# EAGLE design untitled_full_Rs (EAGLE 5.07)
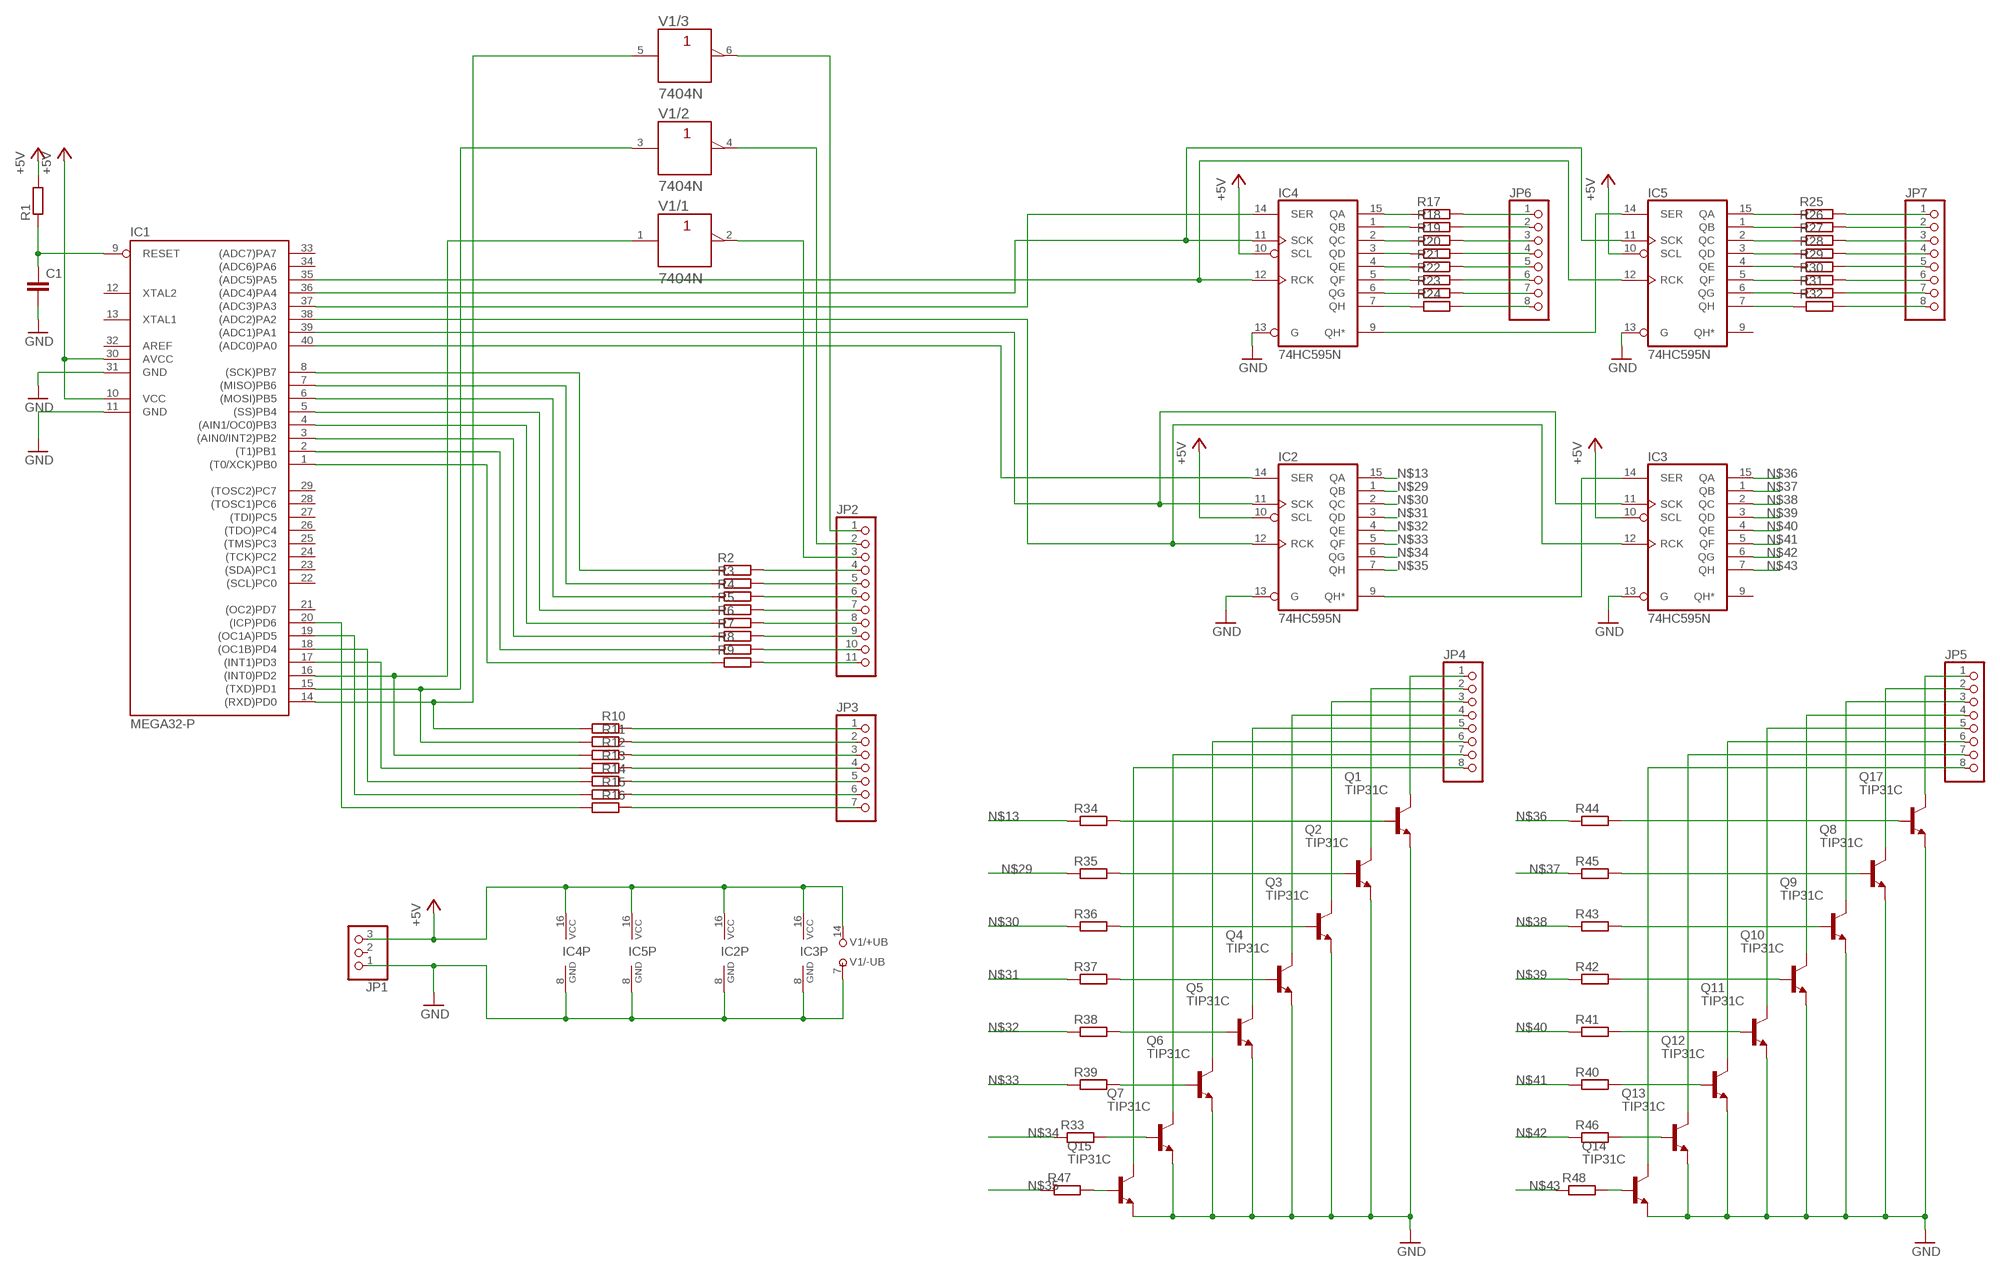
[diagram p0: schematic, sheet 1]

## Parts
C1  C-EU050-024X044  [C050-024X044]
IC1  MEGA32-P  [DIL40]
IC2  74HC595N  [DIL16]
IC3  74HC595N  [DIL16]
IC4  74HC595N  [DIL16]
IC5  74HC595N  [DIL16]
JP1  PINHD-1X3/90  [1X03/90]
JP2  PINHD-1X11/90  [1X11/90]
JP3  PINHD-1X7/90  [1X07/90]
JP4  PINHD-1X8/90  [1X08/90]
JP5  PINHD-1X8/90  [1X08/90]
JP6  PINHD-1X8/90  [1X08/90]
JP7  PINHD-1X8/90  [1X08/90]
Q1  TIP31C  [TO220]
Q2  TIP31C  [TO220]
Q3  TIP31C  [TO220]
Q4  TIP31C  [TO220]
Q5  TIP31C  [TO220]
Q6  TIP31C  [TO220]
Q7  TIP31C  [TO220]
Q8  TIP31C  [TO220]
Q9  TIP31C  [TO220]
Q10  TIP31C  [TO220]
Q11  TIP31C  [TO220]
Q12  TIP31C  [TO220]
Q13  TIP31C  [TO220]
Q14  TIP31C  [TO220]
Q15  TIP31C  [TO220]
Q17  TIP31C  [TO220]
R1  R-EU_0204/7  [0204/7]
R2  R-EU_0207/12  [0207/12]
R3  R-EU_0207/12  [0207/12]
R4  R-EU_0207/12  [0207/12]
R5  R-EU_0207/12  [0207/12]
R6  R-EU_0207/12  [0207/12]
R7  R-EU_0207/12  [0207/12]
R8  R-EU_0207/12  [0207/12]
R9  R-EU_0207/12  [0207/12]
R10  R-EU_0207/12  [0207/12]
R11  R-EU_0207/12  [0207/12]
R12  R-EU_0207/12  [0207/12]
R13  R-EU_0207/12  [0207/12]
R14  R-EU_0207/12  [0207/12]
R15  R-EU_0207/12  [0207/12]
R16  R-EU_0207/12  [0207/12]
R17  R-EU_0207/12  [0207/12]
R18  R-EU_0207/12  [0207/12]
R19  R-EU_0207/12  [0207/12]
R20  R-EU_0207/12  [0207/12]
R21  R-EU_0207/12  [0207/12]
R22  R-EU_0207/12  [0207/12]
R23  R-EU_0207/12  [0207/12]
R24  R-EU_0207/12  [0207/12]
R25  R-EU_0207/12  [0207/12]
R26  R-EU_0207/12  [0207/12]
R27  R-EU_0207/12  [0207/12]
R28  R-EU_0207/12  [0207/12]
R29  R-EU_0207/12  [0207/12]
R30  R-EU_0207/12  [0207/12]
R31  R-EU_0207/12  [0207/12]
R32  R-EU_0207/12  [0207/12]
R33  R-EU_0207/12  [0207/12]
R34  R-EU_0207/12  [0207/12]
R35  R-EU_0207/12  [0207/12]
R36  R-EU_0207/12  [0207/12]
R37  R-EU_0207/12  [0207/12]
R38  R-EU_0207/12  [0207/12]
R39  R-EU_0207/12  [0207/12]
R40  R-EU_0207/12  [0207/12]
R41  R-EU_0207/12  [0207/12]
R42  R-EU_0207/12  [0207/12]
R43  R-EU_0207/12  [0207/12]
R44  R-EU_0207/12  [0207/12]
R45  R-EU_0207/12  [0207/12]
R46  R-EU_0207/12  [0207/12]
R47  R-EU_0207/12  [0207/12]
R48  R-EU_0207/12  [0207/12]
V1  7404N  [DIL14]

## Nets
+5V: IC1.10(VCC) IC1.30(AVCC) IC2.10(SCL) IC2.16(VCC) IC3.10(SCL) IC3.16(VCC) IC4.10(SCL) IC4.16(VCC) IC5.10(SCL) IC5.16(VCC) JP1.3 R1.2 V1.14(/+UB:+UB)
GND: C1.2 IC1.11(GND) IC1.31(GND) IC2.8(GND) IC2.13(G) IC3.8(GND) IC3.13(G) IC4.8(GND) IC4.13(G) IC5.8(GND) IC5.13(G) JP1.1 Q1.3(E) Q2.3(E) Q3.3(E) Q4.3(E) Q5.3(E) Q6.3(E) Q7.3(E) Q8.3(E) Q9.3(E) Q10.3(E) Q11.3(E) Q12.3(E) Q13.3(E) Q14.3(E) Q15.3(E) Q17.3(E) V1.7(/-UB:-UB)
N$1: IC2.9(QH*) IC3.14(SER)
N$2: IC1.40((ADC0)PA0) IC2.14(SER)
N$3: IC1.39((ADC1)PA1) IC2.11(SCK) IC3.11(SCK)
N$4: IC1.38((ADC2)PA2) IC2.12(RCK) IC3.12(RCK)
N$5: IC1.37((ADC3)PA3) IC4.14(SER)
N$6: IC1.36((ADC4)PA4) IC4.11(SCK) IC5.11(SCK)
N$7: IC1.35((ADC5)PA5) IC4.12(RCK) IC5.12(RCK)
N$8: IC4.9(QH*) IC5.14(SER)
N$9: C1.1 IC1.9(RESET) R1.1
N$10: Q1.1(B) R34.2
N$11: Q2.1(B) R35.2
N$12: Q3.1(B) R36.2
N$13: IC2.15(QA) R34.1
N$14: IC1.8((SCK)PB7) R2.1
N$15: IC1.7((MISO)PB6) R3.1
N$16: IC1.6((MOSI)PB5) R4.1
N$17: IC1.5((SS)PB4) R5.1
N$18: IC1.4((AIN1/OC0)PB3) R6.1
N$19: IC1.3((AIN0/INT2)PB2) R7.1
N$20: IC1.2((T1)PB1) R8.1
N$21: IC1.1((T0/XCK)PB0) R9.1
N$22: IC1.20((ICP)PD6) R16.2
N$23: IC1.19((OC1A)PD5) R15.2
N$24: IC1.18((OC1B)PD4) R14.2
N$25: IC1.17((INT1)PD3) R13.2
N$26: IC1.16((INT0)PD2) R12.2 V1.1(/1:A)
N$27: IC1.15((TXD)PD1) R11.2 V1.3(/2:A)
N$28: IC1.14((RXD)PD0) R10.2 V1.5(/3:A)
N$29: IC2.1(QB) R35.1
N$30: IC2.2(QC) R36.1
N$31: IC2.3(QD) R37.1
N$32: IC2.4(QE) R38.1
N$33: IC2.5(QF) R39.1
N$34: IC2.6(QG) R33.1
N$35: IC2.7(QH) R47.1
N$36: IC3.15(QA) R44.1
N$37: IC3.1(QB) R45.1
N$38: IC3.2(QC) R43.1
N$39: IC3.3(QD) R42.1
N$40: IC3.4(QE) R41.1
N$41: IC3.5(QF) R40.1
N$42: IC3.6(QG) R46.1
N$43: IC3.7(QH) R48.1
N$44: JP4.1 Q1.2(C)
N$45: JP4.2 Q2.2(C)
N$46: JP4.3 Q3.2(C)
N$47: JP4.4 Q4.2(C)
N$48: JP4.5 Q5.2(C)
N$49: JP4.6 Q6.2(C)
N$50: JP4.7 Q7.2(C)
N$51: JP4.8 Q15.2(C)
N$53: JP5.1 Q17.2(C)
N$54: JP5.2 Q8.2(C)
N$55: JP5.3 Q9.2(C)
N$56: JP5.4 Q10.2(C)
N$57: JP5.5 Q11.2(C)
N$58: JP5.6 Q12.2(C)
N$59: JP5.7 Q13.2(C)
N$60: JP6.1 R17.2
N$61: JP6.2 R18.2
N$62: JP6.3 R19.2
N$63: JP6.4 R20.2
N$64: JP6.5 R21.2
N$65: JP6.6 R22.2
N$66: JP6.7 R23.2
N$67: JP6.8 R24.2
N$68: JP7.1 R25.2
N$69: JP7.2 R26.2
N$70: JP7.3 R27.2
N$71: JP7.4 R28.2
N$72: JP7.5 R29.2
N$73: JP7.6 R30.2
N$74: JP7.7 R31.2
N$75: JP7.8 R32.2
N$76: JP2.4 R2.2
N$77: JP2.5 R3.2
N$78: JP2.6 R4.2
N$79: JP2.7 R5.2
N$80: JP2.8 R6.2
N$81: JP2.9 R7.2
N$82: JP2.10 R8.2
N$83: JP2.11 R9.2
N$84: JP5.8 Q14.2(C)
N$88: JP3.1 R10.1
N$89: JP3.2 R11.1
N$90: JP3.3 R12.1
N$91: JP3.4 R13.1
N$92: JP3.5 R14.1
N$93: JP3.6 R15.1
N$94: JP3.7 R16.1
N$95: JP2.1 V1.6(/3:Y)
N$101: JP2.2 V1.4(/2:Y)
N$102: JP2.3 V1.2(/1:Y)
N$103: IC4.15(QA) R17.1
N$104: IC4.1(QB) R18.1
N$105: IC4.2(QC) R19.1
N$106: IC4.3(QD) R20.1
N$107: IC4.4(QE) R21.1
N$108: IC4.5(QF) R22.1
N$109: IC4.6(QG) R23.1
N$110: IC4.7(QH) R24.1
N$111: IC5.15(QA) R25.1
N$112: IC5.1(QB) R26.1
N$113: IC5.2(QC) R27.1
N$114: IC5.3(QD) R28.1
N$115: IC5.4(QE) R29.1
N$116: IC5.5(QF) R30.1
N$117: IC5.6(QG) R31.1
N$118: IC5.7(QH) R32.1
N$119: Q7.1(B) R33.2
N$120: Q4.1(B) R37.2
N$121: Q5.1(B) R38.2
N$122: Q6.1(B) R39.2
N$123: Q17.1(B) R44.2
N$124: Q9.1(B) R43.2
N$125: Q10.1(B) R42.2
N$126: Q15.1(B) R47.2
N$127: Q11.1(B) R41.2
N$128: Q12.1(B) R40.2
N$129: Q8.1(B) R45.2
N$133: Q13.1(B) R46.2
N$134: Q14.1(B) R48.2
Unconnected: IC1.12(XTAL2) IC1.13(XTAL1) IC1.21((OC2)PD7) IC1.22((SCL)PC0) IC1.23((SDA)PC1) IC1.24((TCK)PC2) IC1.25((TMS)PC3) IC1.26((TDO)PC4) IC1.27((TDI)PC5) IC1.28((TOSC1)PC6) IC1.29((TOSC2)PC7) IC1.32(AREF) IC1.33((ADC7)PA7) IC1.34((ADC6)PA6) IC3.9(QH*) IC5.9(QH*) JP1.2 V1.8(/4:Y) V1.9(/4:A) V1.10(/5:Y) V1.11(/5:A) V1.12(/6:Y) V1.13(/6:A)

## Library data of the parts
C1 = rcl:C-EU: CAPACITOR, European symbol
IC1 = atmel:MEGA32-P: MICROCONTROLLER 32 Kbytes FLASH 2 Kbytes SRAM 1 Kbytes EEPROM USART 8-channel 10 bit ADC Source: www.atmel.com .. doc2503.pdf
IC2-IC5 = 74xx-eu:74*595: 8-bit SHIFT REGISTER, output latch
JP1 = pinhead:PINHD-1X3: PIN HEADER
JP2 = pinhead:PINHD-1X11: PIN HEADER
JP3 = pinhead:PINHD-1X7: PIN HEADER
JP4-JP7 = pinhead:PINHD-1X8: PIN HEADER
Q1-Q15 Q17 = transistor-npn:TIP31C*: NPN Transistor
R1-R48 = rcl:R-EU_: RESISTOR, European symbol
V1 = 74ttl-din:74*04: Hex INVERTER

## Board
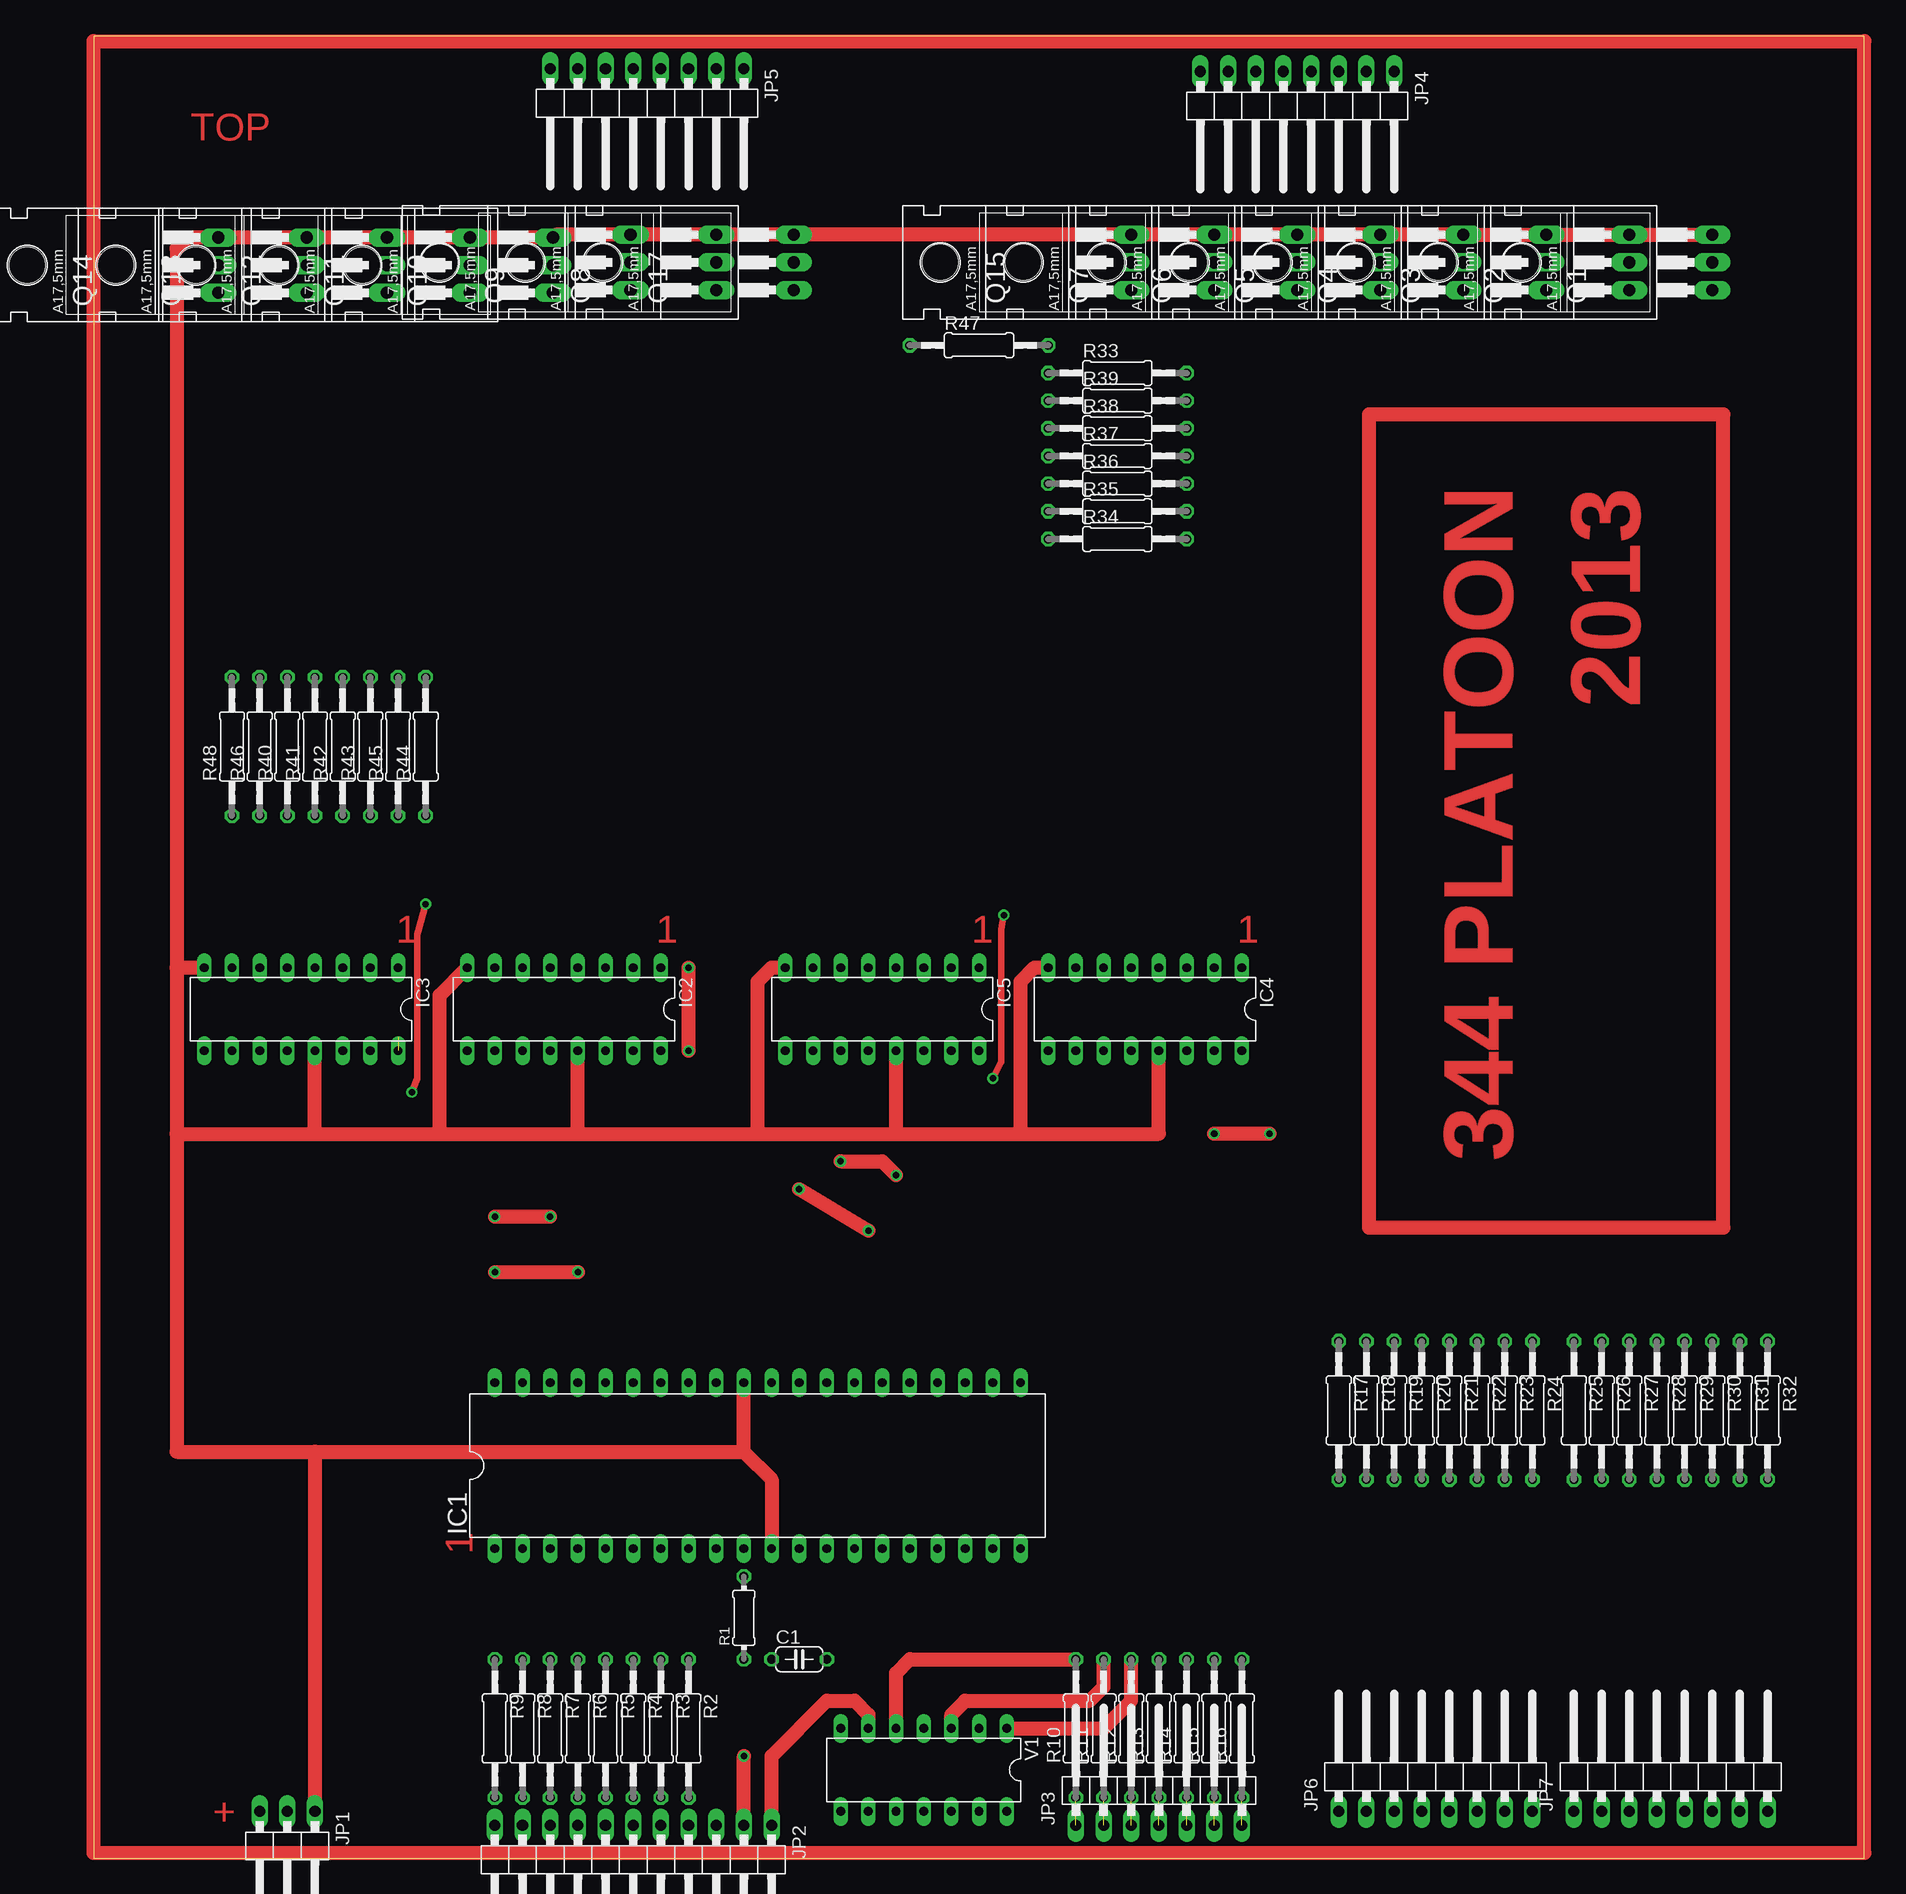
[diagram p1: board, top side]
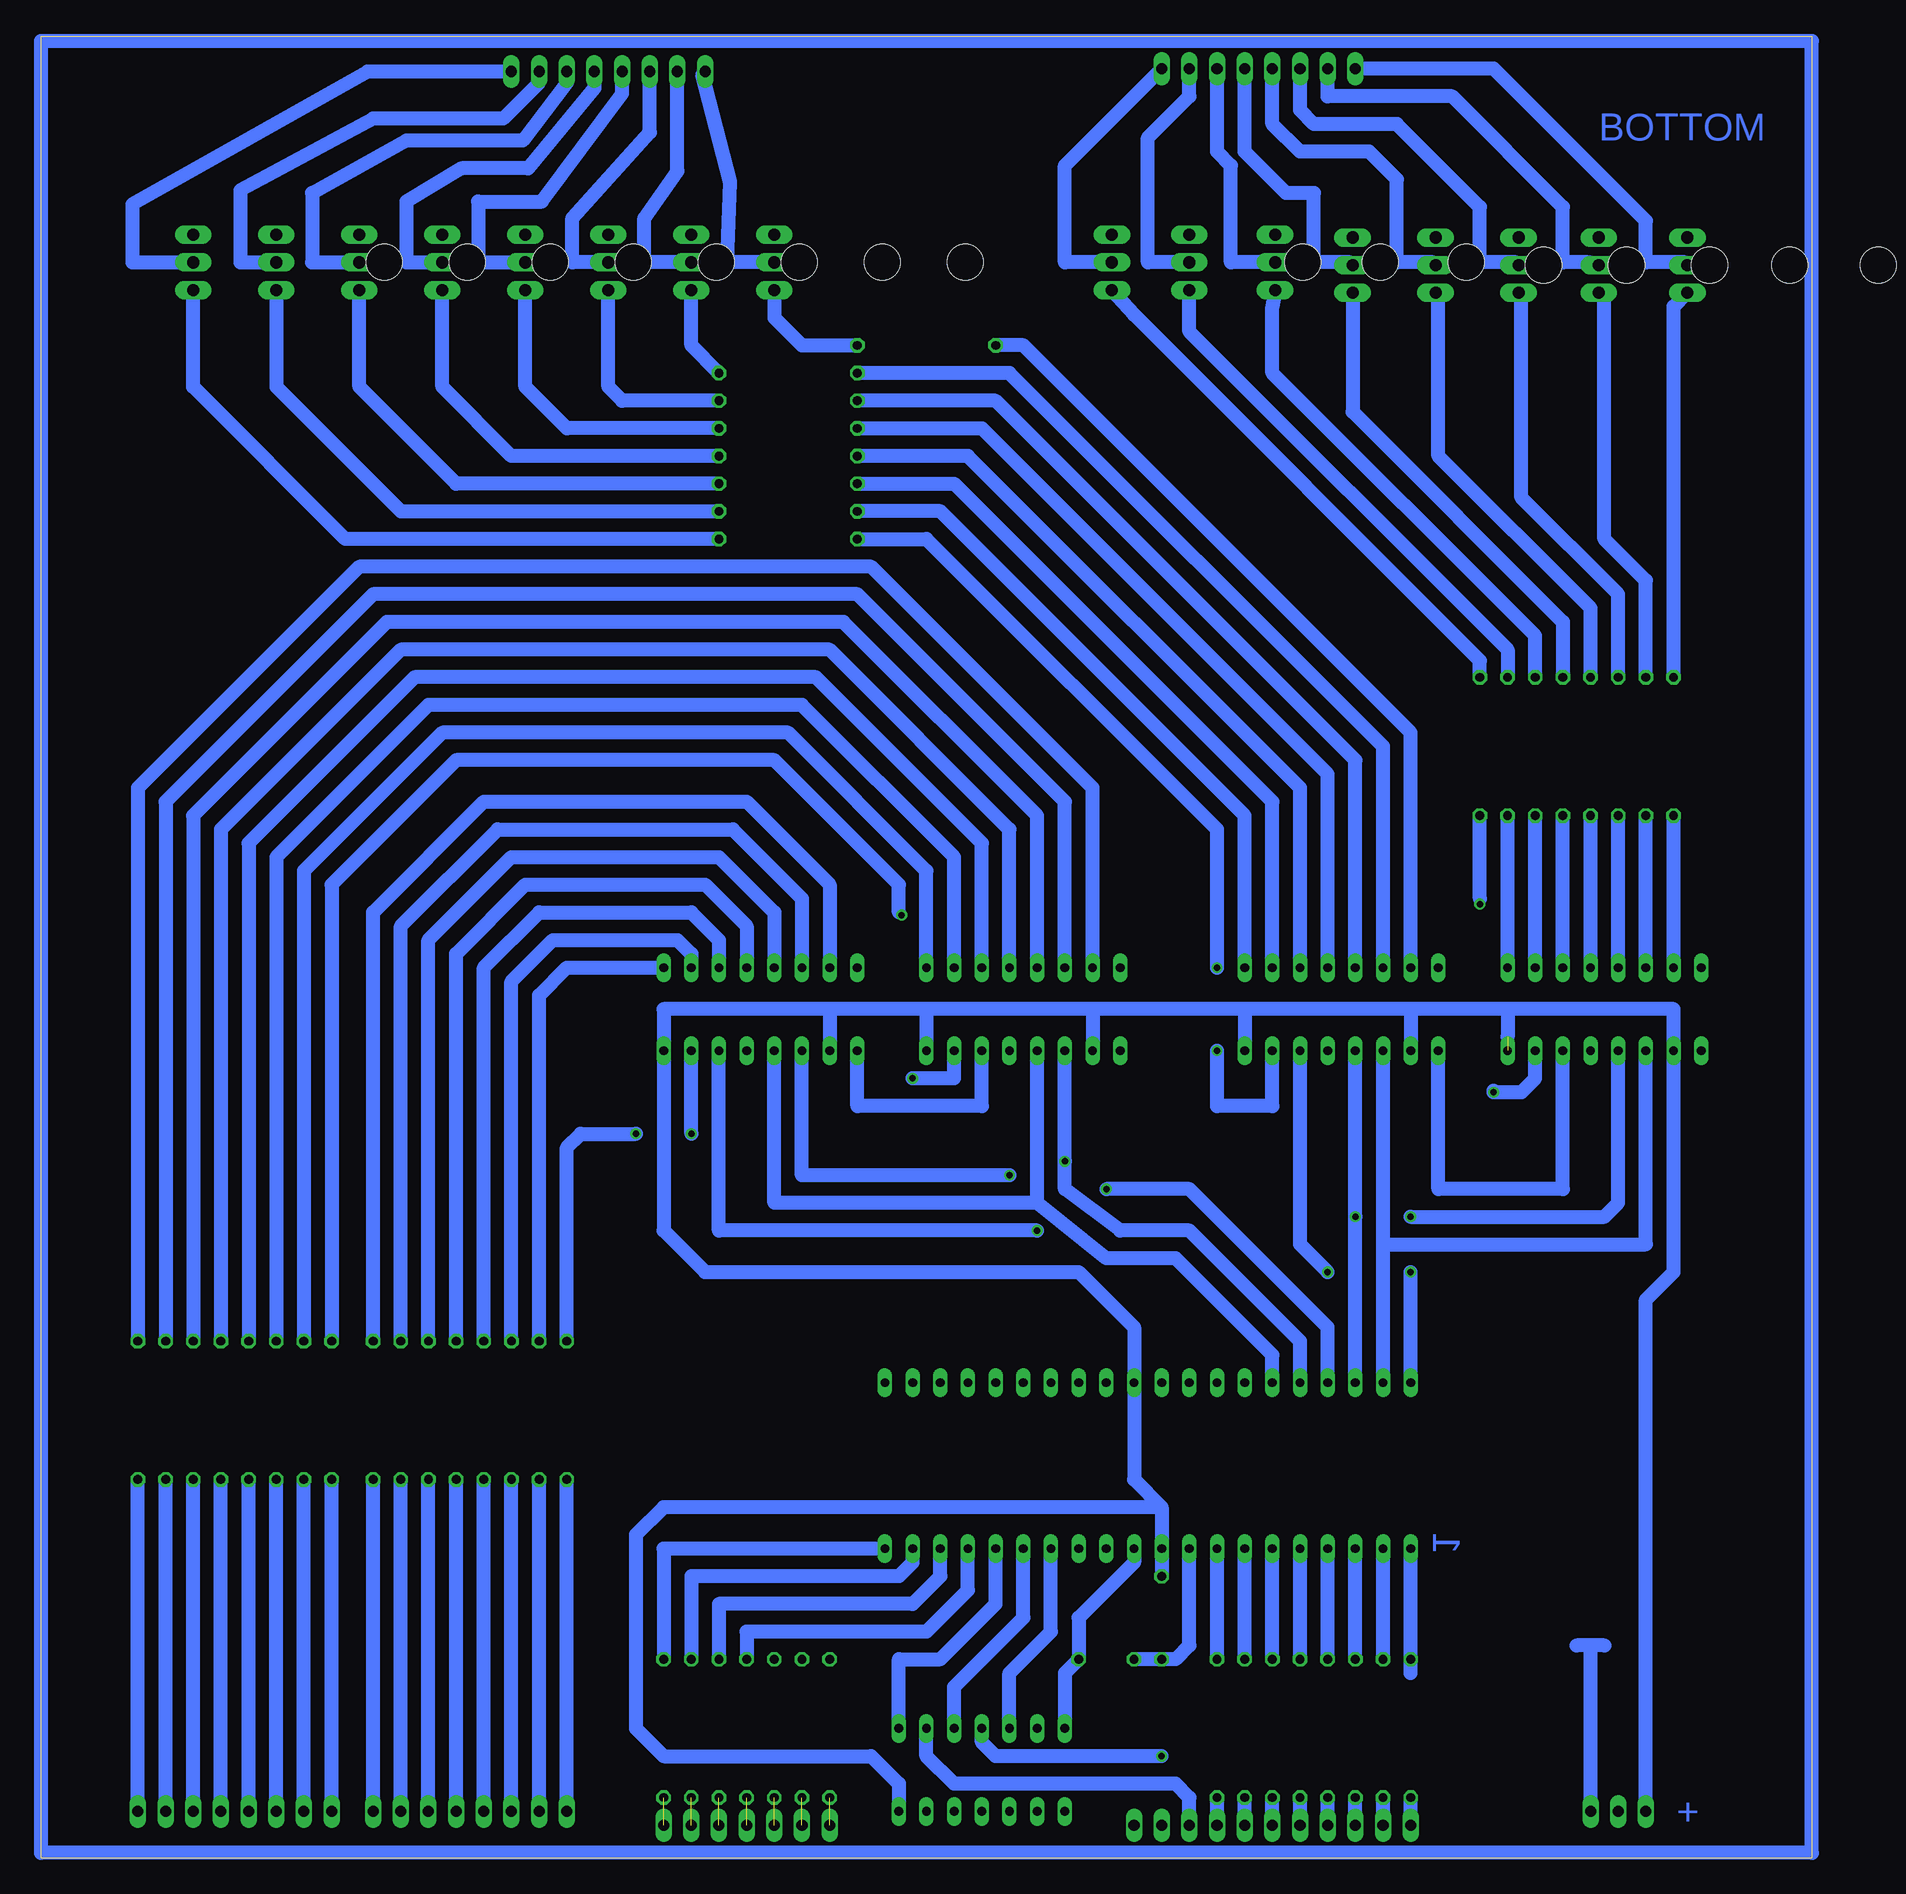
[diagram p2: board, bottom side, seen from below]

Size 162.54 x 167.31 mm. Coordinates in mm from the lower left corner, seen from the top.
Outline: 0,0 162.54,0 162.54,167.31 0,167.31 0,0
Copper layers (1*16): Top 0.035mm / dielectric 1.5mm / Bottom 0.035mm
Design rules "default *": minimum track width 10mil, minimum drill 24mil, track to track 8mil, track to pad 8mil, pad to pad 8mil, via to via 8mil, smd to smd 8mil, copper to edge 40mil, drill to drill 8mil, minimum pad ring 10mil, minimum via ring 8mil, stop-mask expansion 2mil, vias tented up to drill 0mil, thermal gap 10mil

### Footprints (pad centres in the part's own frame; a part is rotated, then mirrored left to right if it is on the bottom)
C050-024X044 = drill 0.813 octagon: 1 -2.54,0; 2 2.54,0
DIL40 = drill 0.813 long: 1 -24.13,-7.62; 2 -21.59,-7.62; 3 -19.05,-7.62; 4 -16.51,-7.62; 5 -13.97,-7.62; 6 -11.43,-7.62; 7 -8.89,-7.62; 8 -6.35,-7.62; 9 -3.81,-7.62; 10 -1.27,-7.62; 11 1.27,-7.62; 12 3.81,-7.62; 13 6.35,-7.62; 14 8.89,-7.62; 15 11.43,-7.62; 16 13.97,-7.62; 17 16.51,-7.62; 18 19.05,-7.62; 19 21.59,-7.62; 20 24.13,-7.62; 21 24.13,7.62; 22 21.59,7.62; 23 19.05,7.62; 24 16.51,7.62; 25 13.97,7.62; 26 11.43,7.62; 27 8.89,7.62; 28 6.35,7.62; 29 3.81,7.62; 30 1.27,7.62; 31 -1.27,7.62; 32 -3.81,7.62; 33 -6.35,7.62; 34 -8.89,7.62; 35 -11.43,7.62; 36 -13.97,7.62; 37 -16.51,7.62; 38 -19.05,7.62; 39 -21.59,7.62; 40 -24.13,7.62
DIL16 = drill 0.813 long: 1 -8.89,-3.81; 2 -6.35,-3.81; 3 -3.81,-3.81; 4 -1.27,-3.81; 5 1.27,-3.81; 6 3.81,-3.81; 7 6.35,-3.81; 8 8.89,-3.81; 9 8.89,3.81; 10 6.35,3.81; 11 3.81,3.81; 12 1.27,3.81; 13 -1.27,3.81; 14 -3.81,3.81; 15 -6.35,3.81; 16 -8.89,3.81
1X03/90 = drill 1.016 long: 1 -2.54,-3.81; 2 0,-3.81; 3 2.54,-3.81
1X11/90 = drill 1.016 long: 1 -12.7,-3.81; 2 -10.16,-3.81; 3 -7.62,-3.81; 4 -5.08,-3.81; 5 -2.54,-3.81; 6 0,-3.81; 7 2.54,-3.81; 8 5.08,-3.81; 9 7.62,-3.81; 10 10.16,-3.81; 11 12.7,-3.81
1X07/90 = drill 1.016 long: 1 -7.62,-3.81; 2 -5.08,-3.81; 3 -2.54,-3.81; 4 0,-3.81; 5 2.54,-3.81; 6 5.08,-3.81; 7 7.62,-3.81
1X08/90 = drill 1.016 long: 1 -8.89,-3.81; 2 -6.35,-3.81; 3 -3.81,-3.81; 4 -1.27,-3.81; 5 1.27,-3.81; 6 3.81,-3.81; 7 6.35,-3.81; 8 8.89,-3.81
TO220 = drill 1.118 long: 1 -2.54,-6.35; 2 0,-6.35; 3 2.54,-6.35 | hole 3.302: 0,11.176
0204/7 = drill 0.813 octagon: 1 -3.81,0; 2 3.81,0
0207/12 = drill 0.813 octagon: 1 -6.35,0; 2 6.35,0
DIL14 = drill 0.813 long: 1 -7.62,-3.81; 2 -5.08,-3.81; 3 -2.54,-3.81; 4 0,-3.81; 5 2.54,-3.81; 6 5.08,-3.81; 7 7.62,-3.81; 8 7.62,3.81; 9 5.08,3.81; 10 2.54,3.81; 11 0,3.81; 12 -2.54,3.81; 13 -5.08,3.81; 14 -7.62,3.81

### Placement (x,y rotation side)
C1  64.77,18.29 0 top
IC1  60.96,36.07 0 top
IC2  43.18,77.98 180 top
IC3  19.05,77.98 180 top
IC4  96.52,77.98 180 top
IC5  72.39,77.98 180 top
JP1  17.78,0.51 180 top
JP2  49.53,-0.76 180 top
JP3  97.79,6.86 0 top
JP4  110.49,160.27 180 top
JP5  50.8,160.53 180 top
JP6  123.19,8.13 0 top
JP7  144.78,8.13 0 top
Q1  142.24,146.56 90 top
Q2  134.62,146.56 90 top
Q3  127,146.56 90 top
Q4  119.38,146.56 90 top
Q5  111.76,146.56 90 top
Q6  104.14,146.56 90 top
Q7  96.52,146.56 90 top
Q8  50.8,146.56 90 top
Q9  42.93,146.56 90 top
Q10  35.81,146.3 90 top
Q11  28.19,146.3 90 top
Q12  20.57,146.3 90 top
Q13  13.21,146.3 90 top
Q14  5.08,146.3 90 top
Q15  88.9,146.56 90 top
Q17  57.91,146.56 90 top
R1  59.69,22.1 90 top
R2  54.61,11.94 270 top
R3  52.07,11.94 270 top
R4  49.53,11.94 270 top
R5  46.99,11.94 270 top
R6  44.45,11.94 270 top
R7  41.91,11.94 270 top
R8  39.37,11.94 270 top
R9  36.83,11.94 270 top
R10  90.17,11.94 90 top
R11  92.71,11.94 90 top
R12  95.25,11.94 90 top
R13  97.79,11.94 90 top
R14  100.33,11.94 90 top
R15  102.87,11.94 90 top
R16  105.41,11.94 90 top
R17  114.3,41.15 270 top
R18  116.84,41.15 270 top
R19  119.38,41.15 270 top
R20  121.92,41.15 270 top
R21  124.46,41.15 270 top
R22  127,41.15 270 top
R23  129.54,41.15 270 top
R24  132.08,41.15 270 top
R25  135.89,41.15 270 top
R26  138.43,41.15 270 top
R27  140.97,41.15 270 top
R28  143.51,41.15 270 top
R29  146.05,41.15 270 top
R30  148.59,41.15 270 top
R31  151.13,41.15 270 top
R32  153.67,41.15 270 top
R33  93.98,136.4 0 top
R34  93.98,121.16 0 top
R35  93.98,123.7 0 top
R36  93.98,126.24 0 top
R37  93.98,128.78 0 top
R38  93.98,131.32 0 top
R39  93.98,133.86 0 top
R40  17.78,102.11 90 top
R41  20.32,102.11 90 top
R42  22.86,102.11 90 top
R43  25.4,102.11 90 top
R44  30.48,102.11 90 top
R45  27.94,102.11 90 top
R46  15.24,102.11 90 top
R47  81.28,138.94 0 top
R48  12.7,102.11 90 top
V1  76.2,8.13 180 top

### Tracks (layer width: path | path; a pad name or v marks a point on that pad's centre or on a via)
+5V  (1 unrouted)
  Bottom 1.27: R1.2 IC1.10 59.69,32.26 | JP1.3 15.24,51.31 12.7,53.85 IC3.10 12.7,77.98 27.94,77.98 | 36.83,77.98 IC2.10 | 27.94,77.98 36.83,77.98 | 27.94,77.98 27.94,75.44 | 36.83,77.98 52.07,77.98 | 52.07,77.98 IC2.16 | 52.07,77.98 66.04,77.98 | 90.17,77.98 105.41,77.98 IC4.16 105.41,57.66 101.6,53.85 67.31,53.85 62.23,48.77 IC1.30 62.23,34.8 59.69,32.26 | 90.17,77.98 IC4.10 | 81.28,77.98 IC5.16 | 81.28,77.98 90.17,77.98 | 66.04,77.98 IC5.10 | 66.04,77.98 81.28,77.98 | V1.14 83.82,6.86 86.36,9.4 105.41,9.4 107.95,11.94 107.95,29.72 105.41,32.26 59.69,32.26
GND
  Top 1.27: 59.69,37.34 IC1.31 | 59.69,37.34 62.23,34.8 IC1.11 | Q1.3 Q2.3 Q3.3 Q4.3 Q5.3 Q6.3 Q7.3 Q15.3 Q17.3 Q8.3 Q9.3 42.42,149.1 Q10.3 Q11.3 Q12.3 Q13.3 Q14.3 8.64,148.84 7.62,147.83 7.62,81.79 | 7.62,81.79 IC3.8 | 7.62,81.79 7.62,66.55 | 7.62,66.55 7.62,37.34 20.32,37.34 | 20.32,37.34 59.69,37.34 | 20.32,37.34 JP1.1 | IC4.8 86.36,81.79 85.09,80.52 85.09,66.55 | 85.09,66.55 97.79,66.55 IC4.13 | 73.66,66.55 85.09,66.55 | 73.66,66.55 IC5.13 | IC5.8 62.23,81.79 60.96,80.52 60.96,66.55 | 60.96,66.55 73.66,66.55 | 44.45,66.55 60.96,66.55 | 44.45,66.55 IC2.13 | IC2.8 31.75,79.25 31.75,66.55 | 31.75,66.55 44.45,66.55 | 20.32,66.55 31.75,66.55 | 20.32,66.55 IC3.13 | 7.62,66.55 20.32,66.55
  Bottom 1.27: IC1.11 62.23,27.18 67.31,22.1 C1.2 68.58,17.02 V1.7 | JP1.1 20.32,19.56
N$1
  Bottom 1.27: IC3.14 22.86,61.47 34.29,61.47 IC2.9
N$2  (via drill 0.6)
  Top 1.27: v36.83,53.85 v44.45,53.85
  Bottom 1.27: IC2.14 46.99,56.39 v44.45,53.85 | IC1.40 v36.83,53.85
N$3
  Bottom 1.27: IC1.39 39.37,56.39 | 39.37,56.39 IC2.11 | IC3.11 15.24,56.39 39.37,56.39
N$4  (via drill 0.6)
  Top 1.27: v41.91,58.93 v36.83,58.93
  Bottom 1.27: IC1.38 v41.91,58.93 IC2.12 | IC3.12 17.78,60.2 19.05,58.93 v36.83,58.93
N$5  (via drill 0.6)
  Top 1.27: v64.77,61.47 v71.12,57.66
  Bottom 1.27: IC1.37 44.45,48.77 57.15,61.47 v64.77,61.47 | IC4.14 100.33,57.66 v71.12,57.66
N$6  (via drill 0.6)
  Top 1.27: v73.66,62.74 72.39,64.01 v68.58,64.01
  Bottom 1.27: IC1.36 46.99,47.5 57.15,57.66 63.5,57.66 68.58,61.47 v68.58,64.01 IC5.11 | IC4.11 92.71,62.74 v73.66,62.74
N$7
  Bottom 1.27: IC1.35 49.53,46.23 58.42,55.12 64.77,55.12 71.12,60.2 | 71.12,60.2 IC5.12 | IC4.12 95.25,60.2 71.12,60.2
N$8
  Bottom 1.27: IC5.14 76.2,69.09 87.63,69.09 IC4.9
N$9
  Bottom 1.27: C1.1 R1.1 58.42,18.29 57.15,19.56 IC1.9
N$10
  Bottom 1.27: R34.2 134.62,121.16 148.59,135.13 Q1.1
N$11
  Bottom 1.27: Q2.1 140.97,135.13 129.54,123.7 R35.2
N$12
  Bottom 1.27: R36.2 124.46,126.24 133.35,135.13 Q3.1
N$13  (via drill 0.6)
  Top 1.27: v54.61,74.17 v54.61,81.79
  Bottom 1.27: IC2.15 49.53,69.09 54.61,69.09 v54.61,74.17 | v54.61,81.79 54.61,94.49 81.28,121.16 R34.1
N$14
  Bottom 1.27: R2.1 IC1.8
N$15
  Bottom 1.27: R3.1 IC1.7
N$16
  Bottom 1.27: R4.1 IC1.6
N$17
  Bottom 1.27: R5.1 IC1.5
N$18
  Bottom 1.27: R6.1 IC1.4
N$19
  Bottom 1.27: R7.1 IC1.3
N$20
  Bottom 1.27: R8.1 IC1.2
N$21
  Bottom 1.27: IC1.1 R9.1 36.83,17.02
N$22
  Bottom 1.27: IC1.20 105.41,28.45 R16.2
N$23
  Bottom 1.27: R15.2 102.87,25.91 83.82,25.91 82.55,27.18 IC1.19
N$24
  Bottom 1.27: R14.2 100.33,23.37 82.55,23.37 80.01,25.91 IC1.18
N$25
  Bottom 1.27: R13.2 97.79,20.83 81.28,20.83 77.47,24.64 IC1.17
N$26
  Top 1.27: R12.2 95.25,14.48 92.71,11.94 V1.1
  Bottom 1.27: V1.1 83.82,18.29 80.01,18.29 74.93,23.37 IC1.16
N$27
  Top 1.27: R11.2 92.71,15.75 91.44,14.48 80.01,14.48 78.74,13.21 V1.3
  Bottom 1.27: IC1.15 72.39,22.1 78.74,15.75 V1.3
N$28
  Top 1.27: R10.2 74.93,18.29 73.66,17.02 V1.5
  Bottom 1.27: IC1.14 69.85,20.83 73.66,17.02 V1.5
N$29
  Bottom 1.27: IC2.1 52.07,95.76 80.01,123.7 R35.1
N$30
  Bottom 1.27: IC2.2 49.53,97.03 78.74,126.24 R36.1
N$31
  Bottom 1.27: IC2.3 46.99,98.3 77.47,128.78 R37.1
N$32
  Bottom 1.27: IC2.4 44.45,99.57 76.2,131.32 R38.1
N$33
  Bottom 1.27: IC2.5 41.91,100.84 74.93,133.86 R39.1
N$34
  Bottom 1.27: IC2.6 39.37,102.11 73.66,136.4 R33.1
N$35
  Bottom 1.27: IC2.7 36.83,103.38 72.39,138.94 R47.1
N$36  (via drill 0.6)
  Top 0.61: v30.48,87.63 29.72,84.84 29.72,71.63 v29.21,70.36
  Bottom 0.61: v30.48,87.63 30.48,88.14
  Bottom 1.27: IC3.15 25.4,71.63 26.67,70.36 28.96,70.36 29.24,70.49 v29.21,70.36 | 30.48,88.14 R44.1
N$37
  Bottom 1.27: IC3.1 R45.1
N$38
  Bottom 1.27: IC3.2 R43.1
N$39
  Bottom 1.27: IC3.3 R42.1
N$40
  Bottom 1.27: IC3.4 R41.1
N$41
  Bottom 1.27: IC3.5 R40.1
N$42
  Bottom 1.27: IC3.6 R46.1
N$43
  Bottom 1.27: IC3.7 R48.1
N$44
  Bottom 1.27: JP4.1 132.59,164.08 154.18,151.89 154.18,146.56 Q1.2
N$45
  Bottom 1.27: JP4.2 116.84,163.07 120.14,159.77 132.08,159.77 144.27,153.16 144.27,146.56 Q2.2
N$46
  Bottom 1.27: JP4.3 114.3,163.07 118.36,157.73 129.03,157.73 137.67,152.91 137.67,146.56 Q3.2
N$47
  Bottom 1.27: JP4.4 111.76,162.56 117.86,155.19 123.95,155.19 129.03,152.15 129.03,146.56 Q4.2
N$48
  Bottom 1.27: JP4.5 109.22,162.05 116.59,152.15 122.43,152.15 122.43,146.56 Q5.2
N$49
  Bottom 1.27: JP4.6 106.68,158.5 113.79,150.62 113.79,146.56 Q6.2
N$50
  Bottom 1.27: JP4.7 104.14,154.94 107.19,150.62 107.19,146.56 Q7.2
N$51
  Bottom 1.27: Q15.2 99.57,146.56 99.31,153.92 101.85,163.83 JP4.8
N$52
  Bottom 1.27: 0,166.88 162.56,166.88 162.56,0.51 0,0.51 0,166.88
N$53
  Bottom 1.27: Q17.2 68.58,146.56 68.58,155.45 JP5.1
N$54
  Bottom 1.27: JP5.2 57.15,161.8 60.96,157.99 60.96,146.56 Q8.2
N$55
  Bottom 1.27: JP5.3 54.61,156.72 53.34,155.45 53.34,146.56 Q9.2
N$56
  Bottom 1.27: JP5.4 52.07,156.72 48.26,152.91 45.72,152.91 45.72,146.56 42.42,146.56 Q10.2
N$57
  Bottom 1.27: JP5.5 49.53,159.26 46.99,156.72 40.64,156.72 38.1,154.18 38.1,146.56 34.8,146.56 Q11.2
N$58
  Bottom 1.27: JP5.6 46.99,160.53 45.72,159.26 38.1,159.26 30.48,151.64 30.48,146.56 27.18,146.56 Q12.2
N$59
  Bottom 1.27: JP5.7 44.45,161.8 33.02,161.8 22.86,151.64 22.86,146.56 20.57,146.56 Q13.2
N$60
  Bottom 1.27: JP6.1 R17.2
N$61
  Bottom 1.27: JP6.2 R18.2
N$62
  Bottom 1.27: JP6.3 R19.2
N$63
  Bottom 1.27: JP6.4 R20.2
N$64
  Bottom 1.27: JP6.5 R21.2
N$65
  Bottom 1.27: JP6.6 R22.2
N$66
  Bottom 1.27: JP6.7 R23.2
N$67
  Bottom 1.27: JP6.8 R24.2
N$68
  Bottom 1.27: JP7.1 R25.2
N$69
  Bottom 1.27: JP7.2 R26.2
N$70
  Bottom 1.27: JP7.3 R27.2
N$71
  Bottom 1.27: JP7.4 R28.2
N$72
  Bottom 1.27: JP7.5 R29.2
N$73
  Bottom 1.27: JP7.6 R30.2
N$74
  Bottom 1.27: JP7.7 R31.2
N$75
  Bottom 1.27: JP7.8 R32.2
N$76
  Bottom 1.27: JP2.4 R2.2
N$77
  Bottom 1.27: JP2.5 R3.2
N$78
  Bottom 1.27: JP2.6 R4.2
N$79
  Bottom 1.27: JP2.7 R5.2
N$80
  Bottom 1.27: JP2.8 R6.2
N$81
  Bottom 1.27: JP2.9 R7.2
N$82
  Bottom 1.27: JP2.10 R8.2
N$83
  Bottom 1.27: JP2.11 R9.2
N$84
  Bottom 1.27: JP5.8 29.21,164.34 15.24,150.37 15.24,146.56 11.68,146.56 Q14.2
N$85
  Top 1.27: 0,0.51 162.56,0.51 162.56,166.88 0,166.88 0,0.51
N$86
  Top 1.27: 117.09,57.91 117.09,132.59 149.61,132.59 149.61,57.91 117.09,57.91
N$87
  Bottom 1.27: 19.05,19.56 21.59,19.56
N$88  (1 unrouted)
N$89  (1 unrouted)
N$90  (1 unrouted)
N$91  (1 unrouted)
N$92  (1 unrouted)
N$93  (1 unrouted)
N$94  (1 unrouted)
N$95
  Top 1.27: V1.6 71.12,13.21 69.85,14.48 67.31,14.48 62.23,9.4 JP2.1
N$101  (via drill 0.6)
  Top 1.27: JP2.2 v59.69,9.4
  Bottom 1.27: V1.4 76.2,10.67 74.93,9.4 v59.69,9.4
N$102
  Bottom 1.27: V1.2 81.28,9.4 78.74,6.86 58.42,6.86 57.15,5.59 JP2.3
N$103  (via drill 0.6)
  Top 1.27: v107.95,66.55 v102.87,66.55
  Bottom 1.27: R17.1 114.3,65.28 113.03,66.55 v107.95,66.55 | v102.87,66.55 IC4.15
N$104
  Bottom 1.27: R18.1 116.84,79.25 114.3,81.79 IC4.1
N$105
  Bottom 1.27: R19.1 119.38,80.52 115.57,84.33 104.14,84.33 102.87,83.06 IC4.2
N$106
  Bottom 1.27: R20.1 121.92,81.79 116.84,86.87 102.87,86.87 100.33,84.33 IC4.3
N$107
  Bottom 1.27: IC4.4 97.79,85.6 101.6,89.41 118.11,89.41 124.46,83.06 R21.1
N$108
  Bottom 1.27: R22.1 127,84.33 119.38,91.95 100.33,91.95 95.25,86.87 IC4.5
N$109
  Bottom 1.27: IC4.6 92.71,88.14 99.06,94.49 120.65,94.49 129.54,85.6 R23.1
N$110
  Bottom 1.27: R24.1 132.08,86.87 121.92,97.03 97.79,97.03 90.17,89.41 IC4.7
N$111  (via drill 0.6)
  Top 0.61: v82.55,71.63 83.31,73.15 83.31,85.34 v83.57,86.61
  Bottom 0.61: v83.57,86.61 83.82,86.87
  Bottom 1.27: R25.1 135.89,89.41 124.46,100.84 95.25,100.84 83.82,89.41 83.82,86.87 | IC5.15 78.74,71.63 v82.55,71.63
N$112
  Bottom 1.27: IC5.1 81.28,90.68 93.98,103.38 125.73,103.38 138.43,90.68 R26.1
N$113
  Bottom 1.27: R27.1 140.97,91.95 127,105.92 92.71,105.92 78.74,91.95 IC5.2
N$114
  Bottom 1.27: IC5.3 76.2,93.22 91.44,108.46 128.27,108.46 143.51,93.22 R28.1
N$115
  Bottom 1.27: R29.1 146.05,94.49 129.54,111 90.17,111 73.66,94.49 IC5.4
N$116
  Bottom 1.27: IC5.5 71.12,95.76 88.9,113.54 130.81,113.54 148.59,95.76 R30.1
N$117
  Bottom 1.27: R31.1 151.13,97.03 132.08,116.08 87.63,116.08 68.58,97.03 IC5.6
N$118
  Bottom 1.27: IC5.7 66.04,98.3 86.36,118.62 133.35,118.62 153.67,98.3 R32.1
N$119
  Bottom 1.27: R33.2 102.87,138.94 Q7.1
N$120
  Bottom 1.27: R37.2 119.38,128.78 125.73,135.13 Q4.1
N$121
  Bottom 1.27: R38.2 114.3,131.32 118.11,135.13 Q5.1
N$122
  Bottom 1.27: R39.2 109.22,133.86 110.49,135.13 Q6.1
N$123
  Bottom 1.27: Q17.1 62.23,141.73 30.48,109.98 R44.2
N$124
  Bottom 1.27: Q9.1 49.53,142.49 49.53,136.4 25.4,112.27 R43.2
N$125
  Bottom 1.27: Q10.1 42.16,132.84 22.86,113.54 R42.2
N$126
  Bottom 1.27: Q15.1 95.25,141.48 92.71,138.94 R47.2
N$127
  Bottom 1.27: R41.2 20.32,114.81 34.29,128.78 34.29,143.51 Q11.1
N$128
  Bottom 1.27: R40.2 17.78,116.08 26.67,124.97 26.67,143.51 Q12.1
N$129
  Bottom 1.27: Q8.1 57.15,140.21 27.94,111 R45.2
N$133
  Bottom 1.27: R46.2 15.24,117.35 19.05,121.16 19.05,143.26 Q13.1
N$134
  Bottom 1.27: R48.2 12.7,142.49 Q14.1

### Text on the board
Top: TOP | 2013 | 1 | 1 | 1 | 1 | 344 PLATOON | 1 | +
Bottom: BOTTOM | 1 | +